# Altium schematic sheet Sheet10.SchDoc
size A3
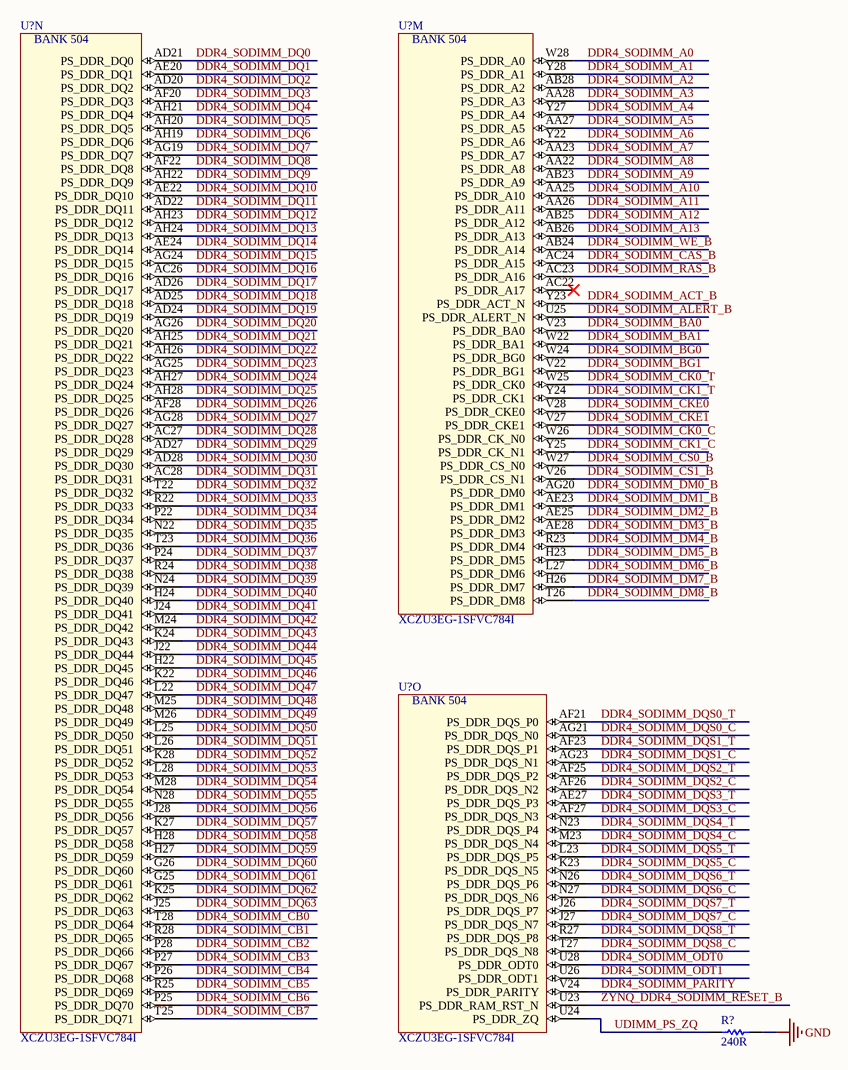
[diagram p0: Sheet10.SchDoc]

## Parts
(Parts that share a designator on the sheet are numbered #1, #2 ... from top to bottom, then left to right.)
R?  value 240R  [RESC1005L_0402]  (hidden comment: RES0402_240R_0W1_1T)
U?#1  XCZU3EG-1SFVC784I  [BGA784x28]  (part N of 22)
U?#2  XCZU3EG-1SFVC784I  [BGA784x28]  (part M of 22)
U?#3  XCZU3EG-1SFVC784I  [BGA784x28]  (part O of 22)

## Nets
GND: R?.1
DDR4_SODIMM_A0: U?#2.W28(PS_DDR_A0)
DDR4_SODIMM_A1: U?#2.Y28(PS_DDR_A1)
DDR4_SODIMM_A2: U?#2.AB28(PS_DDR_A2)
DDR4_SODIMM_A3: U?#2.AA28(PS_DDR_A3)
DDR4_SODIMM_A4: U?#2.Y27(PS_DDR_A4)
DDR4_SODIMM_A5: U?#2.AA27(PS_DDR_A5)
DDR4_SODIMM_A6: U?#2.Y22(PS_DDR_A6)
DDR4_SODIMM_A7: U?#2.AA23(PS_DDR_A7)
DDR4_SODIMM_A8: U?#2.AA22(PS_DDR_A8)
DDR4_SODIMM_A9: U?#2.AB23(PS_DDR_A9)
DDR4_SODIMM_A10: U?#2.AA25(PS_DDR_A10)
DDR4_SODIMM_A11: U?#2.AA26(PS_DDR_A11)
DDR4_SODIMM_A12: U?#2.AB25(PS_DDR_A12)
DDR4_SODIMM_A13: U?#2.AB26(PS_DDR_A13)
DDR4_SODIMM_ACT_B: U?#2.Y23(PS_DDR_ACT_N)
DDR4_SODIMM_ALERT_B: U?#2.U25(PS_DDR_ALERT_N)
DDR4_SODIMM_BA0: U?#2.V23(PS_DDR_BA0)
DDR4_SODIMM_BA1: U?#2.W22(PS_DDR_BA1)
DDR4_SODIMM_BG0: U?#2.W24(PS_DDR_BG0)
DDR4_SODIMM_BG1: U?#2.V22(PS_DDR_BG1)
DDR4_SODIMM_CAS_B: U?#2.AC24(PS_DDR_A15)
DDR4_SODIMM_CB0: U?#1.T28(PS_DDR_DQ64)
DDR4_SODIMM_CB1: U?#1.R28(PS_DDR_DQ65)
DDR4_SODIMM_CB2: U?#1.P28(PS_DDR_DQ66)
DDR4_SODIMM_CB3: U?#1.P27(PS_DDR_DQ67)
DDR4_SODIMM_CB4: U?#1.P26(PS_DDR_DQ68)
DDR4_SODIMM_CB5: U?#1.R25(PS_DDR_DQ69)
DDR4_SODIMM_CB6: U?#1.P25(PS_DDR_DQ70)
DDR4_SODIMM_CB7: U?#1.T25(PS_DDR_DQ71)
DDR4_SODIMM_CK0_C: U?#2.W26(PS_DDR_CK_N0)
DDR4_SODIMM_CK0_T: U?#2.W25(PS_DDR_CK0)
DDR4_SODIMM_CK1_C: U?#2.Y25(PS_DDR_CK_N1)
DDR4_SODIMM_CK1_T: U?#2.Y24(PS_DDR_CK1)
DDR4_SODIMM_CKE0: U?#2.V28(PS_DDR_CKE0)
DDR4_SODIMM_CKE1: U?#2.V27(PS_DDR_CKE1)
DDR4_SODIMM_CS0_B: U?#2.W27(PS_DDR_CS_N0)
DDR4_SODIMM_CS1_B: U?#2.V26(PS_DDR_CS_N1)
DDR4_SODIMM_DM0_B: U?#2.AG20(PS_DDR_DM0)
DDR4_SODIMM_DM1_B: U?#2.AE23(PS_DDR_DM1)
DDR4_SODIMM_DM2_B: U?#2.AE25(PS_DDR_DM2)
DDR4_SODIMM_DM3_B: U?#2.AE28(PS_DDR_DM3)
DDR4_SODIMM_DM4_B: U?#2.R23(PS_DDR_DM4)
DDR4_SODIMM_DM5_B: U?#2.H23(PS_DDR_DM5)
DDR4_SODIMM_DM6_B: U?#2.L27(PS_DDR_DM6)
DDR4_SODIMM_DM7_B: U?#2.H26(PS_DDR_DM7)
DDR4_SODIMM_DM8_B: U?#2.T26(PS_DDR_DM8)
DDR4_SODIMM_DQ0: U?#1.AD21(PS_DDR_DQ0)
DDR4_SODIMM_DQ1: U?#1.AE20(PS_DDR_DQ1)
DDR4_SODIMM_DQ2: U?#1.AD20(PS_DDR_DQ2)
DDR4_SODIMM_DQ3: U?#1.AF20(PS_DDR_DQ3)
DDR4_SODIMM_DQ4: U?#1.AH21(PS_DDR_DQ4)
DDR4_SODIMM_DQ5: U?#1.AH20(PS_DDR_DQ5)
DDR4_SODIMM_DQ6: U?#1.AH19(PS_DDR_DQ6)
DDR4_SODIMM_DQ7: U?#1.AG19(PS_DDR_DQ7)
DDR4_SODIMM_DQ8: U?#1.AF22(PS_DDR_DQ8)
DDR4_SODIMM_DQ9: U?#1.AH22(PS_DDR_DQ9)
DDR4_SODIMM_DQ10: U?#1.AE22(PS_DDR_DQ10)
DDR4_SODIMM_DQ11: U?#1.AD22(PS_DDR_DQ11)
DDR4_SODIMM_DQ12: U?#1.AH23(PS_DDR_DQ12)
DDR4_SODIMM_DQ13: U?#1.AH24(PS_DDR_DQ13)
DDR4_SODIMM_DQ14: U?#1.AE24(PS_DDR_DQ14)
DDR4_SODIMM_DQ15: U?#1.AG24(PS_DDR_DQ15)
DDR4_SODIMM_DQ16: U?#1.AC26(PS_DDR_DQ16)
DDR4_SODIMM_DQ17: U?#1.AD26(PS_DDR_DQ17)
DDR4_SODIMM_DQ18: U?#1.AD25(PS_DDR_DQ18)
DDR4_SODIMM_DQ19: U?#1.AD24(PS_DDR_DQ19)
DDR4_SODIMM_DQ20: U?#1.AG26(PS_DDR_DQ20)
DDR4_SODIMM_DQ21: U?#1.AH25(PS_DDR_DQ21)
DDR4_SODIMM_DQ22: U?#1.AH26(PS_DDR_DQ22)
DDR4_SODIMM_DQ23: U?#1.AG25(PS_DDR_DQ23)
DDR4_SODIMM_DQ24: U?#1.AH27(PS_DDR_DQ24)
DDR4_SODIMM_DQ25: U?#1.AH28(PS_DDR_DQ25)
DDR4_SODIMM_DQ26: U?#1.AF28(PS_DDR_DQ26)
DDR4_SODIMM_DQ27: U?#1.AG28(PS_DDR_DQ27)
DDR4_SODIMM_DQ28: U?#1.AC27(PS_DDR_DQ28)
DDR4_SODIMM_DQ29: U?#1.AD27(PS_DDR_DQ29)
DDR4_SODIMM_DQ30: U?#1.AD28(PS_DDR_DQ30)
DDR4_SODIMM_DQ31: U?#1.AC28(PS_DDR_DQ31)
DDR4_SODIMM_DQ32: U?#1.T22(PS_DDR_DQ32)
DDR4_SODIMM_DQ33: U?#1.R22(PS_DDR_DQ33)
DDR4_SODIMM_DQ34: U?#1.P22(PS_DDR_DQ34)
DDR4_SODIMM_DQ35: U?#1.N22(PS_DDR_DQ35)
DDR4_SODIMM_DQ36: U?#1.T23(PS_DDR_DQ36)
DDR4_SODIMM_DQ37: U?#1.P24(PS_DDR_DQ37)
DDR4_SODIMM_DQ38: U?#1.R24(PS_DDR_DQ38)
DDR4_SODIMM_DQ39: U?#1.N24(PS_DDR_DQ39)
DDR4_SODIMM_DQ40: U?#1.H24(PS_DDR_DQ40)
DDR4_SODIMM_DQ41: U?#1.J24(PS_DDR_DQ41)
DDR4_SODIMM_DQ42: U?#1.M24(PS_DDR_DQ42)
DDR4_SODIMM_DQ43: U?#1.K24(PS_DDR_DQ43)
DDR4_SODIMM_DQ44: U?#1.J22(PS_DDR_DQ44)
DDR4_SODIMM_DQ45: U?#1.H22(PS_DDR_DQ45)
DDR4_SODIMM_DQ46: U?#1.K22(PS_DDR_DQ46)
DDR4_SODIMM_DQ47: U?#1.L22(PS_DDR_DQ47)
DDR4_SODIMM_DQ48: U?#1.M25(PS_DDR_DQ48)
DDR4_SODIMM_DQ49: U?#1.M26(PS_DDR_DQ49)
DDR4_SODIMM_DQ50: U?#1.L25(PS_DDR_DQ50)
DDR4_SODIMM_DQ51: U?#1.L26(PS_DDR_DQ51)
DDR4_SODIMM_DQ52: U?#1.K28(PS_DDR_DQ52)
DDR4_SODIMM_DQ53: U?#1.L28(PS_DDR_DQ53)
DDR4_SODIMM_DQ54: U?#1.M28(PS_DDR_DQ54)
DDR4_SODIMM_DQ55: U?#1.N28(PS_DDR_DQ55)
DDR4_SODIMM_DQ56: U?#1.J28(PS_DDR_DQ56)
DDR4_SODIMM_DQ57: U?#1.K27(PS_DDR_DQ57)
DDR4_SODIMM_DQ58: U?#1.H28(PS_DDR_DQ58)
DDR4_SODIMM_DQ59: U?#1.H27(PS_DDR_DQ59)
DDR4_SODIMM_DQ60: U?#1.G26(PS_DDR_DQ60)
DDR4_SODIMM_DQ61: U?#1.G25(PS_DDR_DQ61)
DDR4_SODIMM_DQ62: U?#1.K25(PS_DDR_DQ62)
DDR4_SODIMM_DQ63: U?#1.J25(PS_DDR_DQ63)
DDR4_SODIMM_DQS0_C: U?#3.AG21(PS_DDR_DQS_N0)
DDR4_SODIMM_DQS0_T: U?#3.AF21(PS_DDR_DQS_P0)
DDR4_SODIMM_DQS1_C: U?#3.AG23(PS_DDR_DQS_N1)
DDR4_SODIMM_DQS1_T: U?#3.AF23(PS_DDR_DQS_P1)
DDR4_SODIMM_DQS2_C: U?#3.AF26(PS_DDR_DQS_N2)
DDR4_SODIMM_DQS2_T: U?#3.AF25(PS_DDR_DQS_P2)
DDR4_SODIMM_DQS3_C: U?#3.AF27(PS_DDR_DQS_N3)
DDR4_SODIMM_DQS3_T: U?#3.AE27(PS_DDR_DQS_P3)
DDR4_SODIMM_DQS4_C: U?#3.M23(PS_DDR_DQS_N4)
DDR4_SODIMM_DQS4_T: U?#3.N23(PS_DDR_DQS_P4)
DDR4_SODIMM_DQS5_C: U?#3.K23(PS_DDR_DQS_N5)
DDR4_SODIMM_DQS5_T: U?#3.L23(PS_DDR_DQS_P5)
DDR4_SODIMM_DQS6_C: U?#3.N27(PS_DDR_DQS_N6)
DDR4_SODIMM_DQS6_T: U?#3.N26(PS_DDR_DQS_P6)
DDR4_SODIMM_DQS7_C: U?#3.J27(PS_DDR_DQS_N7)
DDR4_SODIMM_DQS7_T: U?#3.J26(PS_DDR_DQS_P7)
DDR4_SODIMM_DQS8_C: U?#3.T27(PS_DDR_DQS_N8)
DDR4_SODIMM_DQS8_T: U?#3.R27(PS_DDR_DQS_P8)
DDR4_SODIMM_ODT0: U?#3.U28(PS_DDR_ODT0)
DDR4_SODIMM_ODT1: U?#3.U26(PS_DDR_ODT1)
DDR4_SODIMM_PARITY: U?#3.V24(PS_DDR_PARITY)
DDR4_SODIMM_RAS_B: U?#2.AC23(PS_DDR_A16)
DDR4_SODIMM_WE_B: U?#2.AB24(PS_DDR_A14)
UDIMM_PS_ZQ: R?.2 U?#3.U24(PS_DDR_ZQ)
ZYNQ_DDR4_SODIMM_RESET_B: U?#3.U23(PS_DDR_RAM_RST_N)

Not connected (* = marked no-connect by the designer): U?#2 AC22(PS_DDR_A17)*

## Notes on the sheet
- (in symbol XCZU3EG-1SFVC784I, part M) BANK 504
- (in symbol XCZU3EG-1SFVC784I, part N) BANK 504
- (in symbol XCZU3EG-1SFVC784I, part O) BANK 504

## Library data of the parts
R? = RES0402_240R_0W1_1T: RES SMD 240 OHM 1% 1/10W 0402; Manufacturer 1: Panasonic Electronic Components; Manufacturer Part Number 1: ERJ-2RKF2400X; Package: 0402; ComponentLink1Description: Datasheet; Power: 1/10W; Tolerance: 1%; Supplier 1: Digi-Key; Supplier Part Number 1: P240LCT-ND
U?#1-U?#3 = XCZU3EG-1SFVC784I: IC FPGA 252 I/O 784FCBGA - XILINX ZYNQ ULTRASCALE+; Manufacturer 1: Xilinx Inc.; Package: SFVC784; ComponentLink1Description: Datasheet; Supplier 1: Digi-Key; Supplier Part Number 1: XCZU3EG-1SFVC784I-ND; Manufacturer Part Number 1: XCZU3EG-1SFVC784I